# EAGLE design V1 (EAGLE 9.5.2)
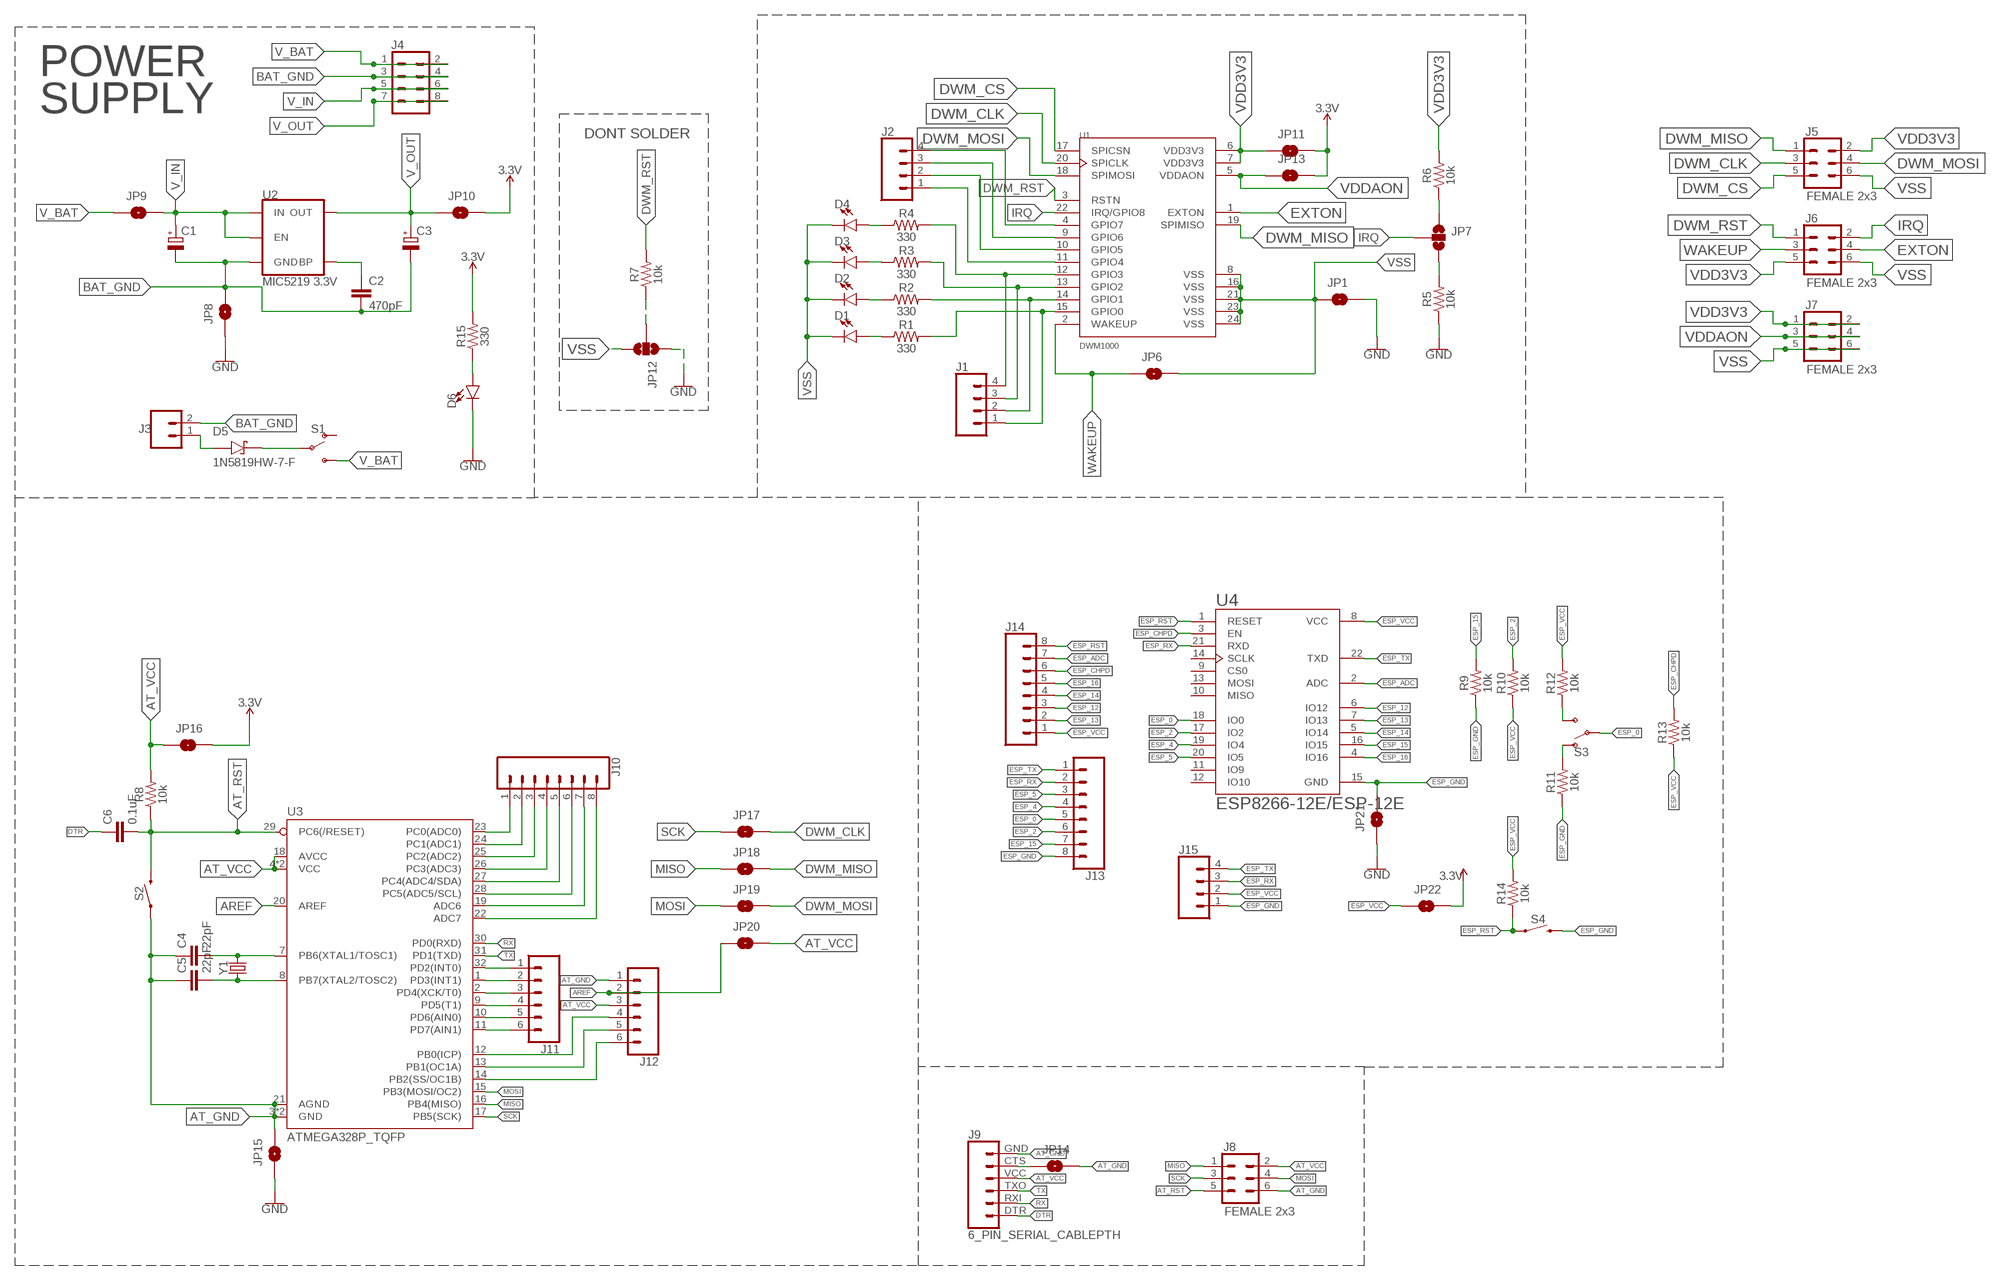
[diagram p0: schematic, sheet 1]

## Parts
C1  CPOL-EUSMCA  [SMC_A]
C2  470pF  470PF-0603-50V-5%  [0603]
C3  CPOL-EUSMCA  [SMC_A]
C4  22pF  22PF-0603-50V-5%  [0603]
C5  22pF  22PF-0603-50V-5%  [0603]
C6  0.1uF  0.1UF-0603-25V-(+80/-20%)  [0603]
D1  LED0603  [LED-0603]
D2  LED0603  [LED-0603]
D3  LED0603  [LED-0603]
D4  LED0603  [LED-0603]
D5  1N5819HW-7-F  [SOD3715X145N]
D6  LED0603  [LED-0603]
J1  CONN_04  [1X04]
J2  CONN_04  [1X04]
J3  CONN_02  [1X02]
J4  CONN_04X2  [2X4]
J5  FEMALE 2x3  CONN_03X2FEMALE  [2X3]
J6  FEMALE 2x3  CONN_03X2FEMALE  [2X3]
J7  FEMALE 2x3  CONN_03X2FEMALE  [2X3]
J8  FEMALE 2x3  CONN_03X2FEMALE  [2X3]
J9  6_PIN_SERIAL_CABLEPTH  [FTDI_BASIC]
J10  CONN_08"  [1X08]
J11  CONN_06SILK_FEMALE_PTH  [1X06]
J12  CONN_06SILK_FEMALE_PTH  [1X06]
J13  CONN_08"  [1X08]
J14  CONN_08"  [1X08]
J15  CONN_04  [1X04]
JP1  JUMPER-SMT_2_NO_NO-SILK  [SMT-JUMPER_2_NO_NO-SILK]
JP6  JUMPER-SMT_2_NO_NO-SILK  [SMT-JUMPER_2_NO_NO-SILK]
JP7  JUMPER-SMT_3_NO_NO_SILK  [SMT-JUMPER_3_0-NO_TRACE_NO-SILK]
JP8  JUMPER-SMT_2_NO_NO-SILK  [SMT-JUMPER_2_NO_NO-SILK]
JP9  JUMPER-SMT_2_NO_NO-SILK  [SMT-JUMPER_2_NO_NO-SILK]
JP10  JUMPER-SMT_2_NO_NO-SILK  [SMT-JUMPER_2_NO_NO-SILK]
JP11  JUMPER-SMT_2_NO_NO-SILK  [SMT-JUMPER_2_NO_NO-SILK]
JP12  JUMPER-SMT_3_NO_NO_SILK  [SMT-JUMPER_3_0-NO_TRACE_NO-SILK]
JP13  JUMPER-SMT_2_NO_NO-SILK  [SMT-JUMPER_2_NO_NO-SILK]
JP14  JUMPER-SMT_2_NO_NO-SILK  [SMT-JUMPER_2_NO_NO-SILK]
JP15  JUMPER-SMT_2_NO_NO-SILK  [SMT-JUMPER_2_NO_NO-SILK]
JP16  JUMPER-SMT_2_NO_NO-SILK  [SMT-JUMPER_2_NO_NO-SILK]
JP17  JUMPER-SMT_2_NO_NO-SILK  [SMT-JUMPER_2_NO_NO-SILK]
JP18  JUMPER-SMT_2_NO_NO-SILK  [SMT-JUMPER_2_NO_NO-SILK]
JP19  JUMPER-SMT_2_NO_NO-SILK  [SMT-JUMPER_2_NO_NO-SILK]
JP20  JUMPER-SMT_2_NO_NO-SILK  [SMT-JUMPER_2_NO_NO-SILK]
JP21  JUMPER-SMT_2_NO_NO-SILK  [SMT-JUMPER_2_NO_NO-SILK]
JP22  JUMPER-SMT_2_NO_NO-SILK  [SMT-JUMPER_2_NO_NO-SILK]
R1  330  330OHM-0603-1/10W-1%  [0603]
R2  330  330OHM-0603-1/10W-1%  [0603]
R3  330  330OHM-0603-1/10W-1%  [0603]
R4  330  330OHM-0603-1/10W-1%  [0603]
R5  10k  10KOHM-0603-1/10W-1%  [0603]
R6  10k  10KOHM-0603-1/10W-1%  [0603]
R7  10k  10KOHM-0603-1/10W-1%  [0603]
R8  10k  10KOHM-0603-1/10W-1%  [0603]
R9  10k  10KOHM-0603-1/10W-1%  [0603]
R10  10k  10KOHM-0603-1/10W-1%  [0603]
R11  10k  10KOHM-0603-1/10W-1%  [0603]
R12  10k  10KOHM-0603-1/10W-1%  [0603]
R13  10k  10KOHM-0603-1/10W-1%  [0603]
R14  10k  10KOHM-0603-1/10W-1%  [0603]
R15  330  330OHM-0603-1/10W-1%  [0603]
S1  SWITCH-SPDT-SMD-AYZ0202  [SWITCH_DPDT_SMD_AYZ0202]
S2  MOMENTARY-SWITCH-SPST-SMD-6.0X3.5MM  [TACTILE_SWITCH_SMD_6.0X3.5MM]
S3  SWITCH-SPDT-SMD-AYZ0202  [SWITCH_DPDT_SMD_AYZ0202]
S4  MOMENTARY-SWITCH-SPST-SMD-6.0X3.5MM  [TACTILE_SWITCH_SMD_6.0X3.5MM]
U1  DWM1000  [XCVR_DWM1000]
U2  MIC5219 3.3V  V_REG_MIC52193.3V  [SOT23-5]
U3  ATMEGA328P_TQFP  [TQFP32-08]
U4  ESP8266-12E/ESP-12E  [XCVR_ESP8266-12E/ESP-12E]
Y1  CRYSTALSMD-HC49UP  [HC49UP]

## Nets
3.3V: JP10.2 JP11.2 JP13.2 JP16.2 JP22.2 R15.2
AREF: J12.2 JP20.1 U3.20(AREF)
AT_GND: C4.1 C5.1 J8.6 J9.GND J12.1 JP14.2 JP15.2 S2.1 U3.3(GND) U3.5(GND) U3.21(AGND)
AT_RST: C6.2 J8.5 R8.1 S2.2 U3.29(PC6(/RESET))
AT_VCC: J8.2 J9.VCC J12.3 JP16.1 JP20.2 R8.2 U3.4(VCC) U3.6(VCC) U3.18(AVCC)
BAT_GND: C1.- C2.2 C3.- J3.2 J4.3 J4.4 JP8.2 U2.2(GND)
DTR: C6.1 J9.DTR
DWM_CLK: J5.3 JP17.2 U1.20(SPICLK)
DWM_CS: J5.5 U1.17(SPICSN)
DWM_MISO: J5.1 JP18.2 U1.19(SPIMISO)
DWM_MOSI: J5.4 JP19.2 U1.18(SPIMOSI)
DWM_RST: J6.1 R7.2 U1.3(RSTN)
ESP_0: J13.5 S3.2(P) U4.18(IO0)
ESP_2: J13.6 R10.2 U4.17(IO2)
ESP_4: J13.4 U4.19(IO4)
ESP_5: J13.3 U4.20(IO5)
ESP_12: J14.3 U4.6(IO12)
ESP_13: J14.2 U4.7(IO13)
ESP_14: J14.4 U4.5(IO14)
ESP_15: J13.7 R9.2 U4.16(IO15)
ESP_16: J14.5 U4.4(IO16)
ESP_ADC: J14.7 U4.2(ADC)
ESP_CHPD: J14.6 R13.2 U4.3(EN)
ESP_GND: J13.8 J15.1 JP21.2 R9.1 R11.1 S4.2 U4.15(GND)
ESP_RST: J14.8 R14.1 S4.1 U4.1(RESET)
ESP_RX: J13.2 J15.3 U4.21(RXD)
ESP_TX: J13.1 J15.4 U4.22(TXD)
ESP_VCC: J14.1 J15.2 JP22.1 R10.1 R12.2 R13.1 R14.2 U4.8(VCC)
EXTON: J6.4 U1.1(EXTON)
GND: D6.C JP1.2 JP8.1 JP12.1 JP15.1 JP21.1 R5.1
IN_BAT: D5.C(K) S1.2(P)
IRQ: J6.2 JP7.2 U1.22(IRQ/GPIO8)
MISO: J8.1 JP18.1 U3.16(PB4(MISO))
MOSI: J8.4 JP19.1 U3.15(PB3(MOSI/OC2))
N$1: J1.4 R4.2 U1.12(GPIO3)
N$2: C2.1 U2.4(BP)
N$3: J1.3 R3.2 U1.13(GPIO2)
N$4: J1.2 R2.2 U1.14(GPIO1)
N$5: J1.1 R1.2 U1.15(GPIO0)
N$6: D4.A R4.1
N$7: D3.A R3.1
N$8: D2.A R2.1
N$9: D1.A R1.1
N$14: J2.1 U1.11(GPIO4)
N$15: JP7.1 R6.1
N$16: J2.2 U1.10(GPIO5)
N$17: J2.3 U1.9(GPIO6)
N$18: J2.4 U1.4(GPIO7)
N$19: JP7.3 R5.2
N$20: D5.A J3.1
N$21: C4.2 U3.7(PB6(XTAL1/TOSC1)) Y1.2
N$22: JP12.2 R7.1
N$23: C5.2 U3.8(PB7(XTAL2/TOSC2)) Y1.1
N$24: J10.1 U3.23(PC0(ADC0))
N$25: J10.2 U3.24(PC1(ADC1))
N$26: J10.3 U3.25(PC2(ADC2))
N$27: J10.4 U3.26(PC3(ADC3))
N$28: J9.CTS JP14.1
N$29: J10.5 U3.27(PC4(ADC4/SDA))
N$30: J10.6 U3.28(PC5(ADC5/SCL))
N$31: J10.7 U3.19(ADC6)
N$32: J10.8 U3.22(ADC7)
N$33: J11.1 U3.32(PD2(INT0))
N$34: J11.2 U3.1(PD3(INT1))
N$35: J11.3 U3.2(PD4(XCK/T0))
N$36: J11.4 U3.9(PD5(T1))
N$37: J11.5 U3.10(PD6(AIN0))
N$38: J11.6 U3.11(PD7(AIN1))
N$39: J12.5 U3.13(PB1(OC1A))
N$40: J12.4 U3.12(PB0(ICP))
N$41: J12.6 U3.14(PB2(SS/OC1B))
N$42: R11.2 S3.1(O)
N$43: R12.1 S3.3(S)
N$44: D6.A R15.1
RX: J9.RXI U3.30(PD0(RXD))
SCK: J8.3 JP17.1 U3.17(PB5(SCK))
TX: J9.TXO U3.31(PD1(TXD))
V_BAT: J4.1 J4.2 JP9.1 S1.3(S)
V_IN: C1.+ J4.5 J4.6 JP9.2 U2.1(IN) U2.3(EN)
V_OUT: C3.+ J4.7 J4.8 JP10.1 U2.5(OUT)
VDD3V3: J5.2 J6.5 J7.1 J7.2 JP11.1 R6.2 U1.6(VDD3V3) U1.7(VDD3V3)
VDDAON: J7.3 J7.4 JP13.1 U1.5(VDDAON)
VSS: D1.C D2.C D3.C D4.C J5.6 J6.6 J7.5 J7.6 JP1.1 JP6.2 JP12.3 U1.8(VSS) U1.16(VSS) U1.21(VSS) U1.23(VSS) U1.24(VSS)
WAKEUP: J6.3 JP6.1 U1.2(WAKEUP)
Unconnected: S1.1(O) U4.9(CS0) U4.10(MISO) U4.11(IO9) U4.12(IO10) U4.13(MOSI) U4.14(SCLK)

## Notes on the sheet
- POWER
- SUPPLY
- DONT SOLDER

## Library data of the parts
C1 C3 = resistor:CPOL-EU: POLARIZED CAPACITOR, European symbol
C2 = SparkFun-Capacitors:470PF: 470pF ceramic capacitors A capacitor is a passive two-terminal electrical component used to store electrical energy temporarily in an electric field.; PROD_ID: CAP-07884
C4 C5 = SparkFun-Capacitors:22PF: 22pF ceramic capacitors A capacitor is a passive two-terminal electrical component used to store electrical energy temporarily in an electric field.; PROD_ID: CAP-07876
C6 = SparkFun-Capacitors:0.1UF: 0.1µF ceramic capacitors A capacitor is a passive two-terminal electrical component used to store electrical energy temporarily in an electric field.; PROD_ID: CAP-00810
D1-D4 D6 = SparkFun-LED:LED: LED (Generic) Standard schematic elements and footprints for 5mm, 3mm, 1206, and 0603 sized LEDs. Generic LEDs with no color specified.
D5 = 1N5819HW-7-F:1N5819HW-7-F: 1N5819HW Series 40 V 1 A Surface Mount Schottky Barrier Rectifier - SOD-123; AVAILABILITY: Unavailable; DESCRIPTION: 1N5819HW Series 40 V 1 A Surface Mount Schottky Barrier Rectifier - SOD-123; MF: Diodes Inc.; MP: 1N5819HW-7-F; PACKAGE: SOD-123 Diodes Inc.; PRICE: None
J1 J2 J15 = SparkFun-Connectors:CONN_04: Multi connection point. Often used as Generic Header-pin footprint for 0.1 inch spaced/style header connections On any of the 0.1 inch spaced packages, you can populate with these: Break Away Headers - Straight (PRT-00116) Break Away Male Headers - Right Angle (PRT-00553) Female Headers (PRT-00115) Break Away Headers - Machine Pin (PRT-00117) Break Away Female Headers - Swiss Machine Pin (PRT-00743) For SCREWTERMINALS and SPRING TERMINALS visit here: Screw Terimnals on SparkFun.com (5mm/3.5mm/2.54mm spacing) This device is also useful as a general connection point to wire up your design to another part of your project. Our various solder wires solder well into these plated through hole pads. Hook-Up Wire - Assortment (Stranded, 22 AWG) (PRT-11375) Hook-Up Wire - Assortment (Solid Core, 22 AWG) (PRT-11367) View the entire wire category on our website here Special notes: Molex polarized connector foot print use with SKU : PRT-08231 with associated crimp pins and housings. 1MM SMD Version SKU: PRT-10208; PROD_ID: CONN-09696
J3 = SparkFun-Connectors:CONN_02: Multi connection point. Often used as Generic Header-pin footprint for 0.1 inch spaced/style header connections On any of the 0.1 inch spaced packages, you can populate with these: Break Away Headers - Straight (PRT-00116) Break Away Male Headers - Right Angle (PRT-00553) Female Headers (PRT-00115) Break Away Headers - Machine Pin (PRT-00117) Break Away Female Headers - Swiss Machine Pin (PRT-00743) For SCREWTERMINALS and SPRING TERMINALS visit here: Screw Terimnals on SparkFun.com (5mm/3.5mm/2.54mm spacing) This device is also useful as a general connection point to wire up your design to another part of your project. Our various solder wires solder well into these plated through hole pads. Hook-Up Wire - Assortment (Stranded, 22 AWG) (PRT-11375) Hook-Up Wire - Assortment (Solid Core, 22 AWG) (PRT-11367) View the entire wire category on our website here Special notes: Molex polarized connector foot print use with: PRT-08233 with associated crimp pins and housings. 2.54_SCREWTERM for use with PRT-10571. 3.5mm Screw Terminal footprints for PRT-08084 5mm Screw Terminal footprints for use with PRT-08432
J4 = SparkFun-Connectors:CONN_04X2: Multi connection point. Often used as Generic Header-pin footprint for 0.1 inch spaced/style header connections On any of the 0.1 inch spaced packages, you can populate with these: Break Away Headers - Straight (PRT-00116) Break Away Male Headers - Right Angle (PRT-00553) Female Headers (PRT-00115) Break Away Headers - Machine Pin (PRT-00117) Break Away Female Headers - Swiss Machine Pin (PRT-00743)
J5-J8 = SparkFun-Connectors:CONN_03X2: Multi connection point. Often used as Generic Header-pin footprint for 0.1 inch spaced/style header connections You can populate with any combo of single row headers, but if you'd like an exact match, check these: Header - 2x3 (Male, 0.1") (PRT-12807) Header - 2x3 (Female, 0.1") (PRT-13010) 2x3 Pin Shrouded Header (PRT-10877) On any of the 0.1 inch spaced packages, you can populate with these: Break Away Headers - Straight (PRT-00116) Break Away Male Headers - Right Angle (PRT-00553) Female Headers (PRT-00115) Break Away Headers - Machine Pin (PRT-00117) Break Away Female Headers - Swiss Machine Pin (PRT-00743) Special note: the shrouded connector mates well with our 3x2 ribbon cables: Ribbon Crimp Connector - 6-pin (2x3, Female) (PRT-10651) Ribbon Cable - 6 wire (15ft) (PRT-10646); PROD_ID: CONN-11566
J9 = SparkFun-Connectors:6_PIN_SERIAL_CABLE: 6-pin header connection for use with the "FTDI BASIC" pinout - CABLE SIDE. Also known as "Arduino Serial Program Header". This is used on a design to provide a 6-pin connection point for serial communication usually from a USB cable (D+/D-) to these headers (RX/TX). It also has the remaining pins necessary for programming in the Arduino evironment (DTR, GND, and sometimes VCC). Note, this device has "CABLE" in the name. It is intended to be used on a design that usually lives on the end of your USB cable and prvides the converter chip (FTDI232 or FTDI231x) to commnicate serial RX/TX. The "sister" device, named "TARGET" is inteneded to be used on a design that contains a target micro-controller that you wish to program. You can populate with some of these: Female Headers (PRT-00115) For reference (or to suit your programming needs) check out these designs: SparkFun FTDI Basic Breakout - 5V (DEV-09716) SparkFun FTDI Basic Breakout - 3.3V (DEV-09873) SparkFun FTDI SmartBasic (DEV-12935) SparkFun Beefy 3 - FTDI Basic Breakout (DEV-13746)
J10 J13 J14 = SparkFun-Connectors:CONN_08: Multi connection point. Often used as Generic Header-pin footprint for 0.1 inch spaced/style header connections On any of the 0.1 inch spaced packages, you can populate with these: Break Away Headers - Straight (PRT-00116) Break Away Male Headers - Right Angle (PRT-00553) Female Headers (PRT-00115) Break Away Headers - Machine Pin (PRT-00117) Break Away Female Headers - Swiss Machine Pin (PRT-00743) Arduino Stackable Header - 8 Pin (PRT-09279) For SCREWTERMINALS and SPRING TERMINALS visit here: Screw Terimnals on SparkFun.com (5mm/3.5mm/2.54mm spacing) This device is also useful as a general connection point to wire up your design to another part of your project. Our various solder wires solder well into these plated through hole pads. Hook-Up Wire - Assortment (Stranded, 22 AWG) (PRT-11375) Hook-Up Wire - Assortment (Solid Core, 22 AWG) (PRT-11367) View the entire wire category on our website here Special notes: Molex polarized connector foot print use with SKU : PRT-08231 with associated crimp pins and housings. 1MM SMD Version SKU: PRT-10208 NOTES ON THE VARIANTS LOCK and LOCK_LONGPADS... This footprint was designed to help hold the alignment of a through-hole component (i.e. 6-pin header) while soldering it into place. You may notice that each hole has been shifted either up or down by 0.005 of an inch from it's more standard position (which is a perfectly straight line). This slight alteration caused the pins (the squares in the middle) to touch the edges of the holes. Because they are alternating, it causes a "brace" to hold the component in place. 0.005 has proven to be the perfect amount of "off-center" position when using our standard breakaway headers. Although looks a little odd when you look at the bare footprint, once you have a header in there, the alteration is very hard to notice. Also,if you push a header all the way into place, it is covered up entirely on the bottom side.; PROD_ID: CONN-08438
J11 J12 = SparkFun-Connectors:CONN_06: Multi connection point. Often used as Generic Header-pin footprint for 0.1 inch spaced/style header connections On any of the 0.1 inch spaced packages, you can populate with these: Break Away Headers - Straight (PRT-00116) Break Away Male Headers - Right Angle (PRT-00553) Female Headers (PRT-00115) Break Away Headers - Machine Pin (PRT-00117) Break Away Female Headers - Swiss Machine Pin (PRT-00743) Arduino Stackable Header - 6 Pin (PRT-09280) For SCREWTERMINALS and SPRING TERMINALS visit here: Screw Terimnals on SparkFun.com (5mm/3.5mm/2.54mm spacing) This device is also useful as a general connection point to wire up your design to another part of your project. Our various solder wires solder well into these plated through hole pads. Hook-Up Wire - Assortment (Stranded, 22 AWG) (PRT-11375) Hook-Up Wire - Assortment (Solid Core, 22 AWG) (PRT-11367) View the entire wire category on our website here; PROD_ID: CONN-08437
JP1 JP6 JP8-JP11 JP13-JP22 = SparkFun-Jumpers:JUMPER-SMT_2_NO: Normally open jumper This jumper has two pads in close proximity to each other. Apply solder to close the connection. Round pads are easier to solder for beginners, but are a lot larger. SparkFun Product that uses the round pads: SparkFun EL Sequencer
JP7 JP12 = SparkFun-Jumpers:JUMPER-SMT_3_NO: Normally open jumper This jumper has three pads in close proximity to each other. Apply solder to close the connection(s).
R1-R4 R15 = SparkFun-Resistors:330OHM: 330Ω resistor A resistor is a passive two-terminal electrical component that implements electrical resistance as a circuit element. Resistors act to reduce current flow, and, at the same time, act to lower voltage levels within circuits. - Wikipedia; PROD_ID: RES-00818
R5-R14 = SparkFun-Resistors:10KOHM: 10kΩ resistor A resistor is a passive two-terminal electrical component that implements electrical resistance as a circuit element. Resistors act to reduce current flow, and, at the same time, act to lower voltage levels within circuits. - Wikipedia; PROD_ID: RES-00824
S1 S3 = SparkFun-Switches:SWITCH-SPDT: Single Pole, Double Throw (SPDT) Switch Single-pole, double-throw (SPDT) switch. Variant Overview SMD-AYZ0202 Surface Mount DPDT Switch (COM-00597) Used on e.g. LilyPad Arduino USB - ATmega32U4 Board PTH-11.6X4.0MM SPDT Mini Power Switch (COM-00102) Used on e.g. SparkFun Simon Says - Through-Hole Soldering Kit (KIT-10547) PTH-11.6X4.0MM-KIT KIT version of SPDT Mini Power Switch - Simplifies soldering by removing tStop of switch pins - only one side can be soldered. PTH-11.6X4.0MM-LOCK LOCK version of SPDT Mini Power Switch - Offset pins hold switch in place for easier soldering. SMD-RIGHT-ANGLE Surface Mount Right Angle Switch (COM-10860) Used on e.g. SparkFun ESP8266 Thing; PROD_ID: SWCH-08179; SF_ID: COM-00597
S2 S4 = SparkFun-Switches:MOMENTARY-SWITCH-SPST: Momentary Switch (Pushbutton) - SPST Normally-open (NO) SPST momentary switches (buttons, pushbuttons). Variants PTH-12MM - 12mm square, through-hole Momentary Pushbutton Switch - 12mm Square (COM-09190) PTH-6.0MM, PTH-6.0MM-KIT - 6.0mm square, through-hole Mini Pushbutton Switch (COM-00097) KIT package intended for soldering kit's - only one side of pads' copper is exposed. PTH-RIGHT-ANGLE-KIT - Right-angle, through-hole Right Angle Tactile Button - Used on SparkFun BigTime Watch Kit SMD-12MM - 12mm square, surface-mount Tactile Button - SMD (12mm) (COM-12993) Used on SparkFun PicoBoard SMD-4.5MM - 4.5mm Square Trackball Switch Used on SparkFun Blackberry Trackballer Breakout SMD-4.6MMX2.8MM - 4.60mm x 2.80mm, surface mount Used on SparkFun SAMD21 Mini Breakout SMD-5.2MM, SMD-5.2-REDUNDANT - 5.2mm square, surface-mount Mini Pushbutton Switch - SMD (COM-08720) Used on Arduino Pro Mini REDUNDANT package connects both switch circuits together SMD-6.0X3.5MM - 6.0 x 3.5mm, surface mount Momentary Reset Switch SMD (COM-08229) SMD-6.2MM-TALL - 6.2mm square, surface mount Tactile Button - SMD (6mm) Used on SparkFun Digital Sandbox SMD-RIGHT-ANGLE - Right-angle, surface mount Used on SparkFun Block for Intel® Edison - Arduino; PROD_ID: SWCH-00815; SF_SKU: COM-08229
U1 = DWM1000:DWM1000: Mod Ieee802.15.4-2011 Uwb Txrx; AVAILABILITY: Unavailable; DESCRIPTION: Mod Ieee802.15.4-2011 Uwb Txrx; MF: Decawave Limited; MP: DWM1000; PACKAGE: Module Decawave; PRICE: None
U2 = SparkFun-IC-Power:V_REG_MIC5219: V_REG MIC5219 Standard 3.3V and 5V 500mA LDO voltage regulator in SOT-23 layout. Micrel part MIC5219. BP (by-pass) pin is used to lower output noise with 470pF cap, may be left open.; PROD_ID: VREG-09872
U3 = SparkFun-IC-Microcontroller:ATMEGA328P_TQFP: Popular 328P in QFP Storefront component: ATmega328 - TQFP (COM-13448) Datasheet SparkFun Products SparkFun RedBoard - Programmed with Arduino (DEV-12757) Arduino Pro Mini 328 - 5V/16MHz (DEV-11113) Arduino Pro Mini 328 - 3.3V/8MHz (DEV-11114) SparkFun OpenLog (DEV-13712) SparkFun MicroView - OLED Arduino Module (DEV-12923) SparkFun Digital Sandbox (DEV-12651) SparkFun PicoBoard (WIG-11888) Arduino Fio (DEV-10116) LilyPad Arduino 328 Main Board (DEV-13342) SparkFun RedStick (DEV-13741) LilyPad MP3 (DEV-11013) LilyPad Arduino SimpleSnap (DEV-10941) SparkFun Stepoko (ROB-13899) SparkFun Geiger Counter (SEN-11345) SparkFun EL Sequencer (COM-12781) Arduino Pro 328 - 5V/16MHz (DEV-10915) CryptoCape (DEV-12773) SparkFun IR Thermometer Evaluation Board - MLX90614 (SEN-10740) SparkFun RedBot Mainboard (ROB-12097) Arduino Pro 328 - 3.3V/8MHz (DEV-10914) SparkFun Block for Intel® Edison - Arduino (DEV-13036) SparkFun Simon Says - Surface Mount Soldering Kit (KIT-10935) SparkFun 7-Segment Serial Display - Red (COM-11441) SparkFun 7-Segment Serial Display - White (COM-11629) SparkFun 7-Segment Serial Display - Yellow (COM-11443) SparkFun 7-Segment Serial Display - Kelly Green (COM-11440) SparkFun 7-Segment Serial Display - Blue (COM-11442) SparkFun OpenSegment Serial Display - 20mm (Blue) (COM-11647) SparkFun OpenSegment Serial Display - 20mm (Green) (COM-11646) SparkFun OpenSegment Serial Display - 20mm (White) (COM-11648) SparkFun OpenSegment Serial Display - 20mm (Red) (COM-11644) SparkFun OpenSegment Serial Display - 20mm (Yellow) (COM-11645) SparkFun OpenSegment Shield (DEV-13190); PROD_ID: IC-09069
U4 = ESP8266-12E_ESP-12E:ESP8266-12E/ESP-12E: ESP-12E WiFi Module; AVAILABILITY: Unavailable; DESCRIPTION: This WiFi module has a 32-bit MCU micro and clock speeds supporting 80 MHz or 160 MHz. Supports the RTOS and integrated Wi-Fi MAC/BB/RF/PA/LNA, and has an on-board antenna.; MF: AI-Thinker; MP: ESP8266-12E/ESP-12E; PACKAGE: None; PRICE: None
Y1 = SparkFun-Clocks:CRYSTAL: Crystals (Generic) These are passive quartz crystals, which can be used as a clock source for a microcontroller. Crystal's are two-terminal devices. They require external "load" capacitors to generate an oscillating signal.

## Board
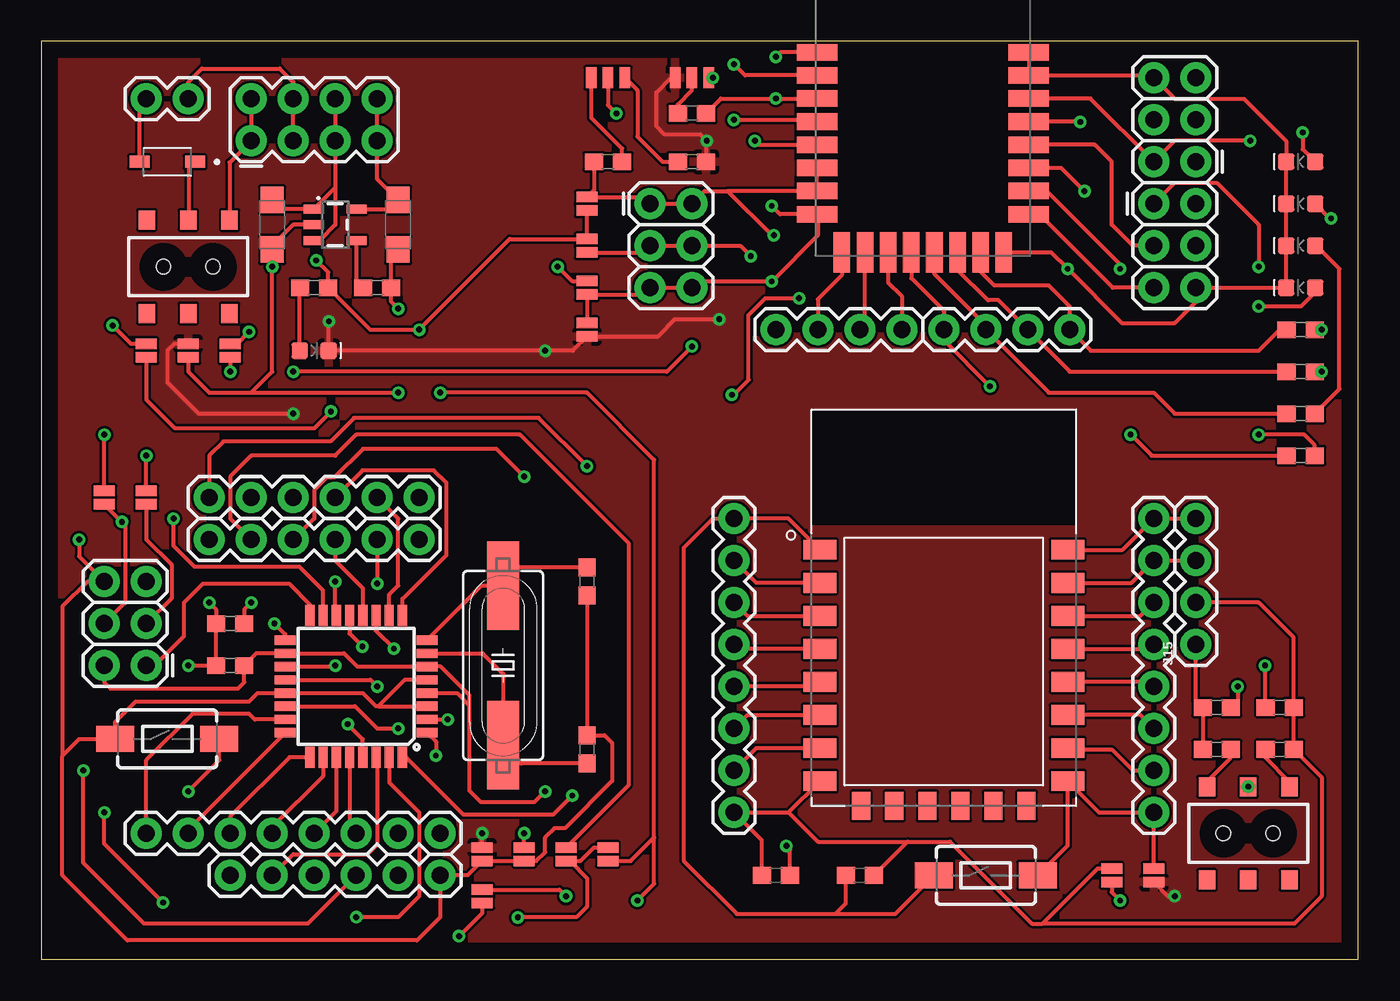
[diagram p1: board, top side]
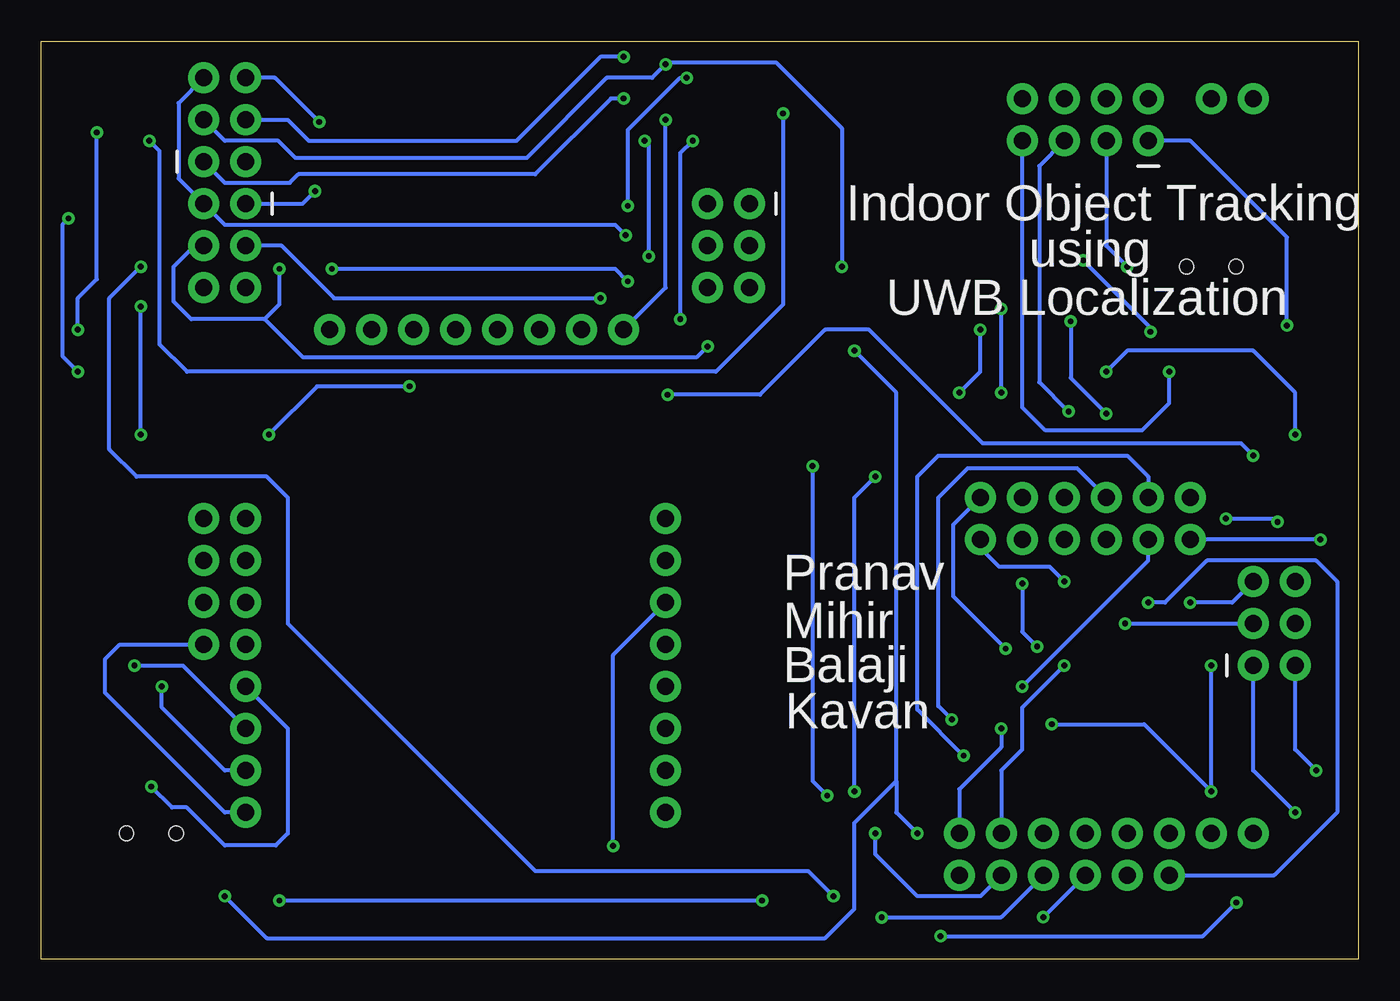
[diagram p2: board, bottom side, seen from below]

Size 79.68 x 55.55 mm. Coordinates in mm from the lower left corner, seen from the top.
Outline: 0,0 79.68,0 79.68,55.55 0,55.55 0,0
Copper layers (1*16): Top 0.035mm / dielectric 1.5mm / Bottom 0.035mm
Design rules "default": minimum track width 6mil, minimum drill 0.35mm, track to track 6mil, track to pad 6mil, pad to pad 6mil, via to via 6mil, smd to smd 6mil, copper to edge 40mil, drill to drill 6mil, minimum pad ring 10mil, minimum via ring 8mil, stop-mask expansion 4mil, vias tented up to drill 0mil, thermal gap 10mil

### Footprints (pad centres in the part's own frame; a part is rotated, then mirrored left to right if it is on the bottom)
SMC_A = smd 1.6 x 1.4: + -1.5,0; - 1.5,0
0603 = smd 1.1 x 1: 1 -0.85,0; 2 0.85,0
LED-0603 = smd 1 x 1: A -0.877,0; C 0.877,0
SOD3715X145N = smd 1.21 x 0.73: A 1.68,0; C -1.68,0
1X04 = drill 1.016 pad 1.88: 1 0,0; 2 2.54,0; 3 5.08,0; 4 7.62,0
1X02 = drill 1.016 pad 1.88: 1 0,0; 2 2.54,0
2X4 = drill 1.016 pad 1.88: 1 -3.81,-1.27; 2 -3.81,1.27; 3 -1.27,-1.27; 4 -1.27,1.27; 5 1.27,-1.27; 6 1.27,1.27; 7 3.81,-1.27; 8 3.81,1.27
2X3 = drill 1.016 pad 1.88: 1 0,0; 2 0,2.54; 3 2.54,0; 4 2.54,2.54; 5 5.08,0; 6 5.08,2.54
FTDI_BASIC = drill 1.016 pad 1.88: CTS 10.16,0; DTR 0,0; GND 12.7,0; RXI 2.54,0; TXO 5.08,0; VCC 7.62,0
1X08 = drill 1.016 pad 1.88: 1 0,0; 2 2.54,0; 3 5.08,0; 4 7.62,0; 5 10.16,0; 6 12.7,0; 7 15.24,0; 8 17.78,0
1X06 = drill 1.016 pad 1.88: 1 0,0; 2 2.54,0; 3 5.08,0; 4 7.62,0; 5 10.16,0; 6 12.7,0
SMT-JUMPER_2_NO_NO-SILK = smd 0.635 x 1.27: 1 -0.406,0; 2 0.406,0
SMT-JUMPER_3_0-NO_TRACE_NO-SILK = smd 0.635 x 1.27: 1 -1.016,0; 2 0,0; 3 1.016,0
SWITCH_DPDT_SMD_AYZ0202 = smd 1 x 1.15: 1 -2.5,2.825; 2 0,2.825; 3 2.5,2.825; 4 -2.5,-2.825; 5 0,-2.825; 6 2.5,-2.825 | hole 0.85: 1.5,0; -1.5,0
TACTILE_SWITCH_SMD_6.0X3.5MM = smd 2.3 x 1.6: 1 -3.15,0; 2 3.15,0
XCVR_DWM1000 = smd 2.45 x 1: 1 -6.4,1.8; 2 -6.4,0.4; 3 -6.4,-1; 4 -6.4,-2.4; 5 -6.4,-3.8; 6 -6.4,-5.2; 7 -6.4,-6.6; 8 -6.4,-8; 17 6.4,-8; 18 6.4,-6.6; 19 6.4,-5.2; 20 6.4,-3.8; 21 6.4,-2.4; 22 6.4,-1; 23 6.4,0.4; 24 6.4,1.8 | smd 1 x 2.45: 9 -4.9,-10.295; 10 -3.5,-10.295; 11 -2.1,-10.295; 12 -0.7,-10.295; 13 0.7,-10.295; 14 2.1,-10.295; 15 3.5,-10.295; 16 4.9,-10.295
SOT23-5 = smd 0.55 x 1.2: 1 -0.95,-1.3; 2 0,-1.3; 3 0.95,-1.3; 4 0.95,1.3; 5 -0.95,1.3
TQFP32-08 = smd 1.27 x 0.559: 1 -4.293,2.8; 2 -4.293,2; 3 -4.293,1.2; 4 -4.293,0.4; 5 -4.293,-0.4; 6 -4.293,-1.2; 7 -4.293,-2; 8 -4.293,-2.8; 17 4.293,-2.8; 18 4.293,-2; 19 4.293,-1.2; 20 4.293,-0.4; 21 4.293,0.4; 22 4.293,1.2; 23 4.293,2; 24 4.293,2.8 | smd 0.559 x 1.27: 9 -2.8,-4.293; 10 -2,-4.293; 11 -1.2,-4.293; 12 -0.4,-4.293; 13 0.4,-4.293; 14 1.2,-4.293; 15 2,-4.293; 16 2.8,-4.293; 25 2.8,4.293; 26 2,4.293; 27 1.2,4.293; 28 0.4,4.293; 29 -0.4,4.293; 30 -1.2,4.293; 31 -2,4.293; 32 -2.8,4.293
XCVR_ESP8266-12E/ESP-12E = smd 2 x 1.2: 1 -7.5,7; 2 -7.5,5; 3 -7.5,3; 4 -7.5,1; 5 -7.5,-1; 6 -7.5,-3; 7 -7.5,-5; 8 -7.5,-7; 15 7.5,-7; 16 7.5,-5; 17 7.5,-3; 18 7.5,-1; 19 7.5,1; 20 7.5,3; 21 7.5,5; 22 7.5,7 | smd 1.1 x 1.7: 9 -5,-8.5; 10 -3,-8.5; 11 -1,-8.5; 12 1,-8.5; 13 3,-8.5; 14 5,-8.5
HC49UP = smd 5.334 x 1.93: 1 -4.826,0; 2 4.826,0

### Placement (x,y rotation side)
C1  13.97,44.45 270 top
C2  20.32,40.64 0 top
C3  21.59,44.45 270 top
C4  33.02,12.7 270 top
C5  33.02,22.86 90 top
C6  11.43,20.32 180 top
D1  76.2,48.26 180 top
D2  76.2,45.72 180 top
D3  76.2,43.18 180 top
D4  76.2,40.64 180 top
D5  7.62,48.26 180 top
D6  16.51,36.83 0 top
J1  62.23,38.1 180 top
J2  52.07,38.1 180 top
J3  6.35,52.07 0 top
J4  16.51,50.8 0 top
J5  67.31,45.72 270 top
J6  69.85,48.26 90 top
J7  36.83,45.72 270 top
J8  6.35,17.78 90 top
J9  11.43,5.08 0 top
J10  6.35,7.62 0 top
J11  10.16,27.94 0 top
J12  10.16,25.4 0 top
J13  67.31,26.67 270 top
J14  41.91,8.89 90 top
J15  69.85,19.05 90 top
JP1  33.02,38.1 270 top
JP6  33.02,40.64 270 top
JP7  34.29,53.34 0 top
JP8  8.89,36.83 270 top
JP9  6.35,36.83 270 top
JP10  11.43,36.83 90 top
JP11  33.02,45.72 270 top
JP12  39.37,53.34 0 top
JP13  33.02,43.18 90 top
JP14  29.21,6.35 270 top
JP15  26.67,6.35 270 top
JP16  34.29,6.35 270 top
JP17  6.35,27.94 90 top
JP18  26.67,3.81 90 top
JP19  3.81,27.94 90 top
JP20  31.75,6.35 270 top
JP21  67.31,5.08 90 top
JP22  64.77,5.08 270 top
R1  76.2,38.1 180 top
R2  76.2,35.56 180 top
R3  76.2,33.02 180 top
R4  76.2,30.48 180 top
R5  39.37,48.26 180 top
R6  34.29,48.26 180 top
R7  39.37,51.18 0 top
R8  11.43,17.78 0 top
R9  71.12,15.24 0 top
R10  74.93,15.24 180 top
R11  71.12,12.7 0 top
R12  74.93,12.7 0 top
R13  44.45,5.08 0 top
R14  49.53,5.08 0 top
R15  16.51,40.64 0 top
S1  8.89,41.91 0 top
S2  7.62,13.34 0 top
S3  73.03,7.62 0 top
S4  57.15,5.08 0 top
U1  53.34,53.09 0 top
U2  17.78,44.45 270 top
U3  19.05,16.51 180 top
U4  54.61,17.78 0 top
Y1  27.94,17.78 270 top

### Tracks (layer width: path | path; a pad name or v marks a point on that pad's centre or on a via)
3.3V  (via drill 0.35)
  Top 0.254: JP10.2 11.84,37.24 v12.57,37.97 | v16.64,42.29 17.36,41.57 R15.2 19.9,38.1 v22.86,38.1 28.35,43.59 JP13.2 JP11.2 | v65.28,3.56 64.77,4.06 JP22.2 | v24.13,34.29 33.02,34.29 37.08,30.23 37.08,7.37 | JP16.2 35.66,5.94 37.08,7.37 | v36.07,3.56 37.08,4.57 37.08,7.37
  Bottom 0.254: v16.64,42.29 12.57,38.23 v12.57,37.97 | v65.28,3.56 v36.07,3.56 | v24.13,34.29 22.86,35.56 v22.86,38.1
AREF  (via drill 0.35)
  Top 0.254: U3.20 19.92,16.91 v20.32,16.51 | J12.2 11.43,26.67 11.43,29.21 12.7,30.48 17.78,30.48 19.05,31.75 28.96,31.75 35.56,25.15 35.56,10.57 JP20.1
  Bottom 0.254: J12.2 12.7,24.13 v20.32,16.51
AT_GND  (via drill 0.35)
  Top 0.254: U3.5 21.99,16.91 20.39,15.31 | 1.27,12.32 1.27,5.08 5.21,1.14 22.73,1.14 24.13,2.54 J9.GND 25.81,5.08 JP15.2 JP14.2 29.95,5.94 30.48,6.48 30.48,7.37 31.05,7.94 31.69,7.94 34.54,10.79 34.54,13.08 34.08,13.55 C4.1 C5.1 | v2.29,25.4 2.29,24.38 J8.6 2.79,22.86 1.27,21.34 1.27,12.32 | 20.39,15.31 U3.3 | 20.39,15.31 20.25,15.31 19.45,16.11 U3.21 13.09,16.11 12.57,15.6 5.71,15.6 4.47,14.35 S2.1 2.29,13.34 1.27,12.32
  Bottom 0.254: v2.29,25.4 J12.1
AT_RST  (via drill 0.35)
  Top 0.254: U3.29 19.45,13.32 v18.54,14.22 | v8.89,17.78 R8.1 C6.2 10.58,21.17 v10.16,21.59 | v8.89,10.16 10.77,12.04 S2.2
  Bottom 0.254: v18.54,14.22 12.95,14.22 v8.89,10.16 v8.89,17.78 | J8.5 7.62,21.59 v10.16,21.59
AT_VCC  (via drill 0.35)
  Top 0.254: J9.VCC 16.13,2.16 6.22,2.16 2.54,5.84 v2.54,11.43 | J8.2 3.81,16.76 4.19,16.38 11.9,16.38 12.28,16.76 R8.2 13.01,18.51 U3.18 18.32,18.51 19.12,17.71 U3.6 24.16,17.71 25.89,15.98 25.89,15.37 | v28.83,2.54 32.38,2.54 33.02,3.17 33.02,4.9 31.98,5.94 | JP16.1 33.43,6.76 32.61,5.94 31.98,5.94 | 25.89,15.37 25.89,10.22 26.61,9.5 29.82,9.5 v30.48,10.16 | v29.21,29.21 27.53,30.89 19.46,30.89 17.73,29.16 17.27,29.16 16.51,28.39 16.51,26.67 J12.3 | U3.4 25.15,16.11 25.89,15.37 | JP20.2 31.98,5.94
  Bottom 0.254: v2.54,11.43 3.81,12.7 J8.2 | J9.VCC 21.59,2.54 v28.83,2.54 | v30.48,10.16 30.48,27.94 v29.21,29.21
BAT_GND  (via drill 0.35)
  Top 0.254: JP8.2 8.89,35.56 10.16,34.29 12.7,34.29 | 12.7,34.29 13.97,35.56 v13.97,41.91 C1.- 13.97,43.18 15.24,44.45 U2.2 | C3.- 21.17,42.53 C2.2 21.17,39.79 v21.59,39.37 | 12.7,34.29 v21.59,34.29 | J3.2 8.89,53.09 9.7,53.9 14.43,53.9 15.24,53.09 J4.4 J4.3
  Bottom 0.254: J4.3 15.24,43.18 v13.97,41.91 | v21.59,34.29 v21.59,39.37
DTR  (via drill 0.35)
  Top 0.254: v12.7,21.59 12.28,21.17 C6.1
  Bottom 0.254: v12.7,21.59 11.68,21.59 9.14,24.13 2.54,24.13 1.27,22.86 1.27,8.89 5.08,5.08 J9.DTR
DWM_CLK  (via drill 0.35)
  Top 0.254: J5.3 66.04,43.18 64.77,44.45 64.77,48.26 63.74,49.29 U1.20 | JP17.2 v6.35,30.48 | v41.78,34.16 41.91,34.16 42.8,35.05 42.8,38.99 43.81,40.01 v45.85,40.01
  Bottom 0.254: v6.35,30.48 7.09,31.22 22.72,31.22 29.6,38.1 32.26,38.1 36.2,34.16 v41.78,34.16 | v45.85,40.01 61.98,40.01 65.15,43.18 J5.3
DWM_CS
  Top 0.254: U1.17 60.38,45.09 64.82,40.64 J5.5
DWM_MISO  (via drill 0.35)
  Top 0.254: J5.1 68.58,46.99 71.12,46.99 73.66,44.45 v73.66,41.91 | v63.12,46.48 61.72,47.89 U1.19 | JP18.2 31.34,4.22 v31.75,3.81
  Bottom 0.254: J5.1 63.88,45.72 v63.12,46.48 | v31.75,3.81 33.27,5.33 49.78,5.33 64.77,20.32 64.77,27.94 66.04,29.21 73.91,29.21 75.56,30.86 75.56,40.01 v73.66,41.91
DWM_MOSI  (via drill 0.35)
  Top 0.254: U1.18 60.83,46.49 65.28,42.04 v65.28,41.78 | v39.37,37.08 37.85,35.56 v15.24,35.56 | JP19.2 v3.81,31.75
  Bottom 0.254: v65.28,41.78 65.28,39.62 66.17,38.73 | J5.4 70.41,43.18 71.68,41.91 71.68,39.8 70.61,38.73 66.17,38.73 | 66.17,38.73 63.88,36.45 40.01,36.45 v39.37,37.08 | v3.81,31.75 3.81,34.29 6.35,36.83 13.97,36.83 v15.24,35.56
DWM_RST  (via drill 0.35)
  Top 0.254: R7.2 41.12,52.09 v44.45,52.09 U1.3
  Bottom 0.254: J6.1 68.58,46.99 64.64,46.99 64.14,47.5 49.8,47.5 45.21,52.09 v44.45,52.09
ESP_0  (via drill 0.35)
  Top 0.254: J13.5 67.04,16.78 U4.18
  Bottom 0.254: J13.5 64.77,13.97 64.77,7.62 65.5,6.89 68.58,6.89 70.88,9.19 71.77,9.19 S3.2
  other vias: 73.03,10.45
ESP_2  (via drill 0.35)
  Top 0.254: J13.6 66.5,14.78 U4.17 | R10.2 74.04,15.28 v74.04,17.78
  Bottom 0.254: v74.04,17.78 71.12,17.78 J13.6
ESP_4
  Top 0.254: U4.19 67.04,18.78 J13.4
ESP_5
  Top 0.254: U4.20 66.5,20.78 J13.3
ESP_12
  Top 0.254: J14.3 42.72,14.78 U4.6
ESP_13
  Top 0.254: J14.2 43.26,12.78 U4.7
ESP_14
  Top 0.254: U4.5 46.84,16.51 J14.4
ESP_15  (via drill 0.35)
  Top 0.254: U4.16 62.19,12.7 64.77,12.7 66.04,11.43 J13.7 | v72.39,16.51 72.39,15.66 R9.2
  Bottom 0.254: J13.7 68.58,11.43 72.39,15.24 v72.39,16.51
ESP_16
  Top 0.254: U4.4 42.18,18.78 J14.5
ESP_ADC
  Top 0.254: U4.2 43.26,22.78 J14.7
ESP_CHPD  (via drill 0.35)
  Top 0.254: J14.6 42.72,20.78 U4.3 | R13.2 45.3,6.64 v45.09,6.86
  Bottom 0.254: v45.09,6.86 45.09,18.41 J14.6
ESP_GND
  Top 0.254: S4.2 62.11,6.89 U4.15 64,8.89 J13.8 JP21.2 | J15.1 69.85,15.66 R9.1 R11.1
  Bottom 0.254: J13.8 68.58,8.89 75.82,16.13 75.82,18.16 74.93,19.05 J15.1
ESP_RST
  Top 0.254: U4.1 45.22,26.67 J14.8 40.64,26.67 38.86,24.89 38.86,5.97 42.08,2.75 48.05,2.75 | 48.05,2.75 48.68,3.38 R14.1 | 48.05,2.75 51.67,2.75 S4.1
ESP_RX
  Top 0.254: U4.21 65.96,22.78 J13.2 J15.3
ESP_TX
  Top 0.254: U4.22 65.42,24.78 J13.1 J15.4
ESP_VCC
  Top 0.254: 45.22,8.89 J14.1 43.6,7.2 R13.1 | 45.22,8.89 U4.8 | R14.2 52.41,7.11 | 52.41,7.11 54.99,7.11 59.94,2.16 60.58,2.16 | 45.22,8.89 47,7.11 52.41,7.11 | J15.2 73.66,21.59 75.78,19.47 R10.1 R12.2 77.47,11.01 77.47,3.81 75.82,2.16 60.58,2.16 | JP22.1 63.91,5.49 62.74,4.32 60.58,2.16
EXTON  (via drill 0.35)
  Top 0.254: U1.1 44.73,54.89 v44.45,54.61
  Bottom 0.254: J6.4 64.77,50.8 63.5,49.53 50.93,49.53 45.85,54.61 v44.45,54.61
GND  (via drill 0.35)
  Top 0.254: JP8.1 8.03,37.24 7.62,36.83 7.62,34.92 9.53,33.02 v15.24,33.02 | v17.4,38.61 17.39,38.6 D6.C v30.48,36.83 32.16,36.83 JP1.2 37.31,37.69 38.35,38.73 v41.02,38.73 | JP21.1 68.17,3.81 v68.58,3.81 | R5.1 40.22,49.49 v40.26,49.53 39.88,49.91 37.72,49.91 37.21,50.42 37.21,52.45 38.1,53.34 JP12.1 | JP15.1 v26.67,7.62
  Bottom 0.254: v17.4,38.61 17.4,35.18 v15.24,33.02 | v40.26,49.53 41.02,48.77 v41.02,38.73 | 27.94,10.79 27.94,8.89 v26.67,7.62 | v68.58,3.81 66.04,1.27 32.26,1.27 30.48,3.05 30.48,8.26 27.94,10.79 | v30.48,36.83 27.94,34.29 27.94,10.79
  pour Top: -3.81,-1.27 -3.81,57.15 82.55,57.15 82.55,-1.27
IN_BAT
  Top 0.254: S1.2 8.92,44.76 8.92,47.88 D5.C
IRQ  (via drill 0.35)
  Top 0.254: U1.22 63.48,52.09 J6.2 68.58,49.53 v73.15,49.53 | JP7.2 34.29,51.69 v34.8,51.18
  Bottom 0.254: v34.8,51.18 34.8,39.62 38.86,35.56 70.87,35.56 72.54,37.24 72.54,48.92 v73.15,49.53
MISO  (via drill 0.35)
  Top 0.254: JP18.1 26.67,2.79 v25.27,1.39 | v7.37,3.43 3.81,6.99 v3.81,8.89 | J8.1 6.86,17.78 8.64,19.56 8.64,21.59 9.78,22.73 14.99,22.73 16.25,21.47 U3.16
  Bottom 0.254: v25.27,1.39 9.4,1.39 v7.37,3.43 | v3.81,8.89 6.35,11.43 J8.1
MOSI  (via drill 0.35)
  Top 0.254: JP19.1 v4.88,26.47 5.08,26.26 5.08,21.59 J8.4 | U3.15 17.05,22.32 15.62,23.75 9.27,23.75 8,25.02 v8,26.67
  Bottom 0.254: v8,26.67 5.08,26.67 v4.88,26.47
N$1  (via drill 0.35)
  Top 0.254: U1.12 52.64,41.21 54.61,39.24 J1.4 54.61,37.47 v57.4,34.67 | v65.91,31.75 67.18,30.48 R4.2
  Bottom 0.254: v65.91,31.75 62.99,34.67 v57.4,34.67
N$2
  Top 0.254: C2.1 19.08,41.03 U2.4
N$3
  Top 0.254: U1.13 54.04,41.46 57.15,38.35 J1.3 60.96,34.29 67.31,34.29 68.58,33.02 R3.2
N$4
  Top 0.254: U1.14 55.44,41.72 57.28,39.88 57.91,39.88 J1.2 62.23,35.56 R2.2
N$5
  Top 0.254: U1.15 56.84,41.59 57.66,40.77 60.96,40.77 62.23,39.5 J1.1 63.5,36.83 73.66,36.83 74.93,38.1 R1.2
N$6  (via drill 0.35)
  Top 0.254: R4.1 77.05,31.11 76.42,31.75 v73.66,31.75 | v73.66,39.5 76.2,39.5 77.34,40.64 D4.A
  Bottom 0.254: v73.66,31.75 v73.66,39.5
N$7
  Top 0.254: R3.1 78.54,34.51 78.54,41.78 77.14,43.18 D3.A
N$8  (via drill 0.35)
  Top 0.254: D2.A 77.97,44.83 v78.03,44.83 | v77.47,35.56 R2.1
  Bottom 0.254: v78.03,44.83 78.41,44.45 78.41,36.5 v77.47,35.56
N$9  (via drill 0.35)
  Top 0.254: R1.1 v77.47,38.1 | v76.33,50.04 76.33,49.01 D1.A
  Bottom 0.254: v76.33,50.04 76.33,41.15 77.47,40.01 v77.47,38.1
N$14
  Top 0.254: U1.11 51.24,40.96 52.07,40.13 J2.1
N$15
  Top 0.254: R6.1 35.14,49.06 33.27,50.93 JP7.1
N$16
  Top 0.254: J2.2 49.84,38.41 U1.10
N$17
  Top 0.254: U1.9 48.44,41.39 46.99,39.94 J2.3
N$18  (via drill 0.35)
  Top 0.254: v41.91,50.8 45.72,50.8 45.83,50.69 U1.4
  Bottom 0.254: J2.4 41.91,40.64 v41.91,50.8
N$19
  Top 0.254: JP7.3 36.07,52.58 36.07,49.78 37.59,48.26 R5.2
N$20
  Top 0.254: D5.A 5.94,51.66 J3.1
N$21
  Top 0.254: U3.7 26.7,18.51 27.94,17.27 Y1.2 29.04,11.85 C4.2
N$22
  Top 0.254: JP12.2 39.37,52.58 38.52,51.73 R7.1
N$23
  Top 0.254: U3.8 26.64,22.61 27.81,22.61 | 27.81,22.61 Y1.1 | C5.2 28.92,23.71 27.81,22.61
N$24
  Top 0.254: J10.1 6.35,12.06 9.14,14.86 12.57,14.86 12.92,14.51 U3.23
N$25
  Top 0.254: U3.24 8.89,7.84 J10.2
N$26
  Top 0.254: U3.25 15.01,12.22 11.43,8.64 J10.3
N$27
  Top 0.254: U3.26 17.05,11.08 13.97,8 J10.4
N$28  (via drill 0.35)
  Top 0.254: JP14.1 v29.21,7.62
  Bottom 0.254: J9.CTS 22.86,3.81 26.67,3.81 29.21,6.35 v29.21,7.62
N$29
  Top 0.254: U3.27 17.85,8.96 J10.5
N$30
  Top 0.254: U3.28 18.65,8.02 J10.6
N$31  (via drill 0.35)
  Top 0.254: U3.19 17.71,17.71 v17.78,17.78
  Bottom 0.254: J10.7 21.59,11.43 20.32,12.7 20.32,15.24 v17.78,17.78
N$32  (via drill 0.35)
  Top 0.254: U3.22 18.98,15.31 20.32,13.97 v21.59,13.97
  Bottom 0.254: v21.59,13.97 21.59,12.83 24.13,10.29 J10.8
N$33  (via drill 0.35)
  Top 0.254: U3.32 22.07,12.22 25.53,8.76 30.99,8.76 v32.13,9.91 | v33.02,29.84 30.1,32.77 18.92,32.77 17.5,31.34 11.02,31.34 10.16,30.48 J11.1
  Bottom 0.254: v33.02,29.84 33.02,10.79 v32.13,9.91
N$34  (via drill 0.35)
  Top 0.254: U3.1 23.88,13.18 v23.88,12.32
  Bottom 0.254: v23.88,12.32 26.67,15.11 26.67,29.21 25.4,30.48 13.97,30.48 12.7,29.21 J11.2
N$35  (via drill 0.35)
  Top 0.254: U3.2 v24.59,14.51
  Bottom 0.254: v24.59,14.51 25.4,15.32 25.4,27.94 23.62,29.72 17.02,29.72 J11.3
N$36
  Top 0.254: U3.9 21.85,21.82 24.51,24.48 24.51,28.83 23.75,29.59 19.43,29.59 J11.4
N$37
  Top 0.254: U3.10 21.05,22.07 21.59,22.61 21.59,26.67 J11.5
N$38  (via drill 0.35)
  Top 0.254: U3.11 20.25,19.88 v21.34,18.8
  Bottom 0.254: J11.6 24.51,26.29 24.51,21.97 v21.34,18.8
N$39  (via drill 0.35)
  Top 0.254: U3.13 18.65,19.7 v19.43,18.92 | J12.5 v20.32,22.73
  Bottom 0.254: v19.43,18.92 20.32,19.81 v20.32,22.73
N$40
  Top 0.254: J12.4 17.78,24.13 19.45,22.46 U3.12
N$41  (via drill 0.35)
  Top 0.254: U3.14 17.78,20.87 v17.78,22.86
  Bottom 0.254: v17.78,22.86 18.67,23.75 21.72,23.75 22.86,24.89 J12.6
N$42
  Top 0.254: R11.2 71.97,12.19 70.53,10.75 S3.1
N$43
  Top 0.254: R12.1 74.08,12.19 75.53,10.75 S3.3
N$44
  Top 0.254: D6.A 15.63,40.61 R15.1
RX
  Top 0.254: J9.RXI 15.24,6.35 19.76,6.35 20.32,6.91 20.32,12.14 U3.30
SCK  (via drill 0.35)
  Top 0.254: JP17.1 6.35,25.4 7.87,23.88 7.87,21.84 J8.3 | U3.17 14.76,19.66 v14.1,20.32
  Bottom 0.254: v14.1,20.32 J8.3
TX  (via drill 0.35)
  Top 0.254: U3.31 21.05,10.7 22.86,8.89 22.86,3.81 21.59,2.54 v19.05,2.54
  Bottom 0.254: v19.05,2.54 J9.TXO
V_BAT  (via drill 0.35)
  Top 0.254: J4.2 J4.1 11.39,48.22 S1.3 | JP9.1 5.43,37.24 v4.32,38.35
  Bottom 0.254: J4.1 10.16,49.53 4.32,43.69 v4.32,38.35
V_IN  (via drill 0.35)
  Top 0.254: J4.6 J4.5 17.78,46.7 | 17.78,46.7 U2.1 14.52,45.4 C1.+ | 17.78,46.7 17.78,44.45 16.83,43.5 U2.3 | JP9.2 6.35,33.88 8.1,32.13 16.51,32.13 v17.53,33.15
  Bottom 0.254: v17.53,33.15 19.3,34.92 19.3,48.01 J4.5
V_OUT  (via drill 0.35)
  Top 0.254: U2.5 21.04,45.4 C3.+ 20.32,47.22 J4.7 J4.8 | JP10.1 v11.43,35.56
  Bottom 0.254: v11.43,35.56 11.43,33.66 13.08,32 18.92,32 20.32,33.4 J4.7
VDD3V3  (via drill 0.35)
  Top 0.254: U1.6 U1.7 41.53,46.49 | 41.53,46.49 40.14,46.49 J7.2 J7.1 36.42,46.13 JP11.1 33.44,46.55 R6.2 | 41.53,46.49 44.2,43.81 v44.32,43.81
  Bottom 0.254: J6.5 71.37,51.82 71.37,47.24 J5.2 68.58,44.45 44.96,44.45 v44.32,43.81
VDDAON  (via drill 0.35)
  Top 0.254: JP13.1 36.42,42.77 J7.3 J7.4 42.29,43.18 v42.93,42.55 | v43.18,49.53 43.42,49.29 U1.5
  Bottom 0.254: v43.18,49.53 42.93,49.28 v42.93,42.55
VSS  (via drill 0.35)
  Top 0.254: JP1.1 JP6.2 36.42,40.23 J7.5 J7.6 39.75,41.02 v44.2,41.02 46.99,43.81 46.99,45.04 U1.8 44.7,45.09 v44.2,45.59 | U1.16 61.09,42.79 v62.1,41.78 65.38,38.51 68.58,38.51 69.85,39.78 J5.6 D4.C D3.C D2.C D1.C 75.32,49.52 72.77,52.07 68.58,52.07 J6.6 67.16,53.49 U1.23 U1.24 | v40.64,53.34 JP12.3 | v62.87,50.67 59.75,50.67 U1.21
  Bottom 0.254: v62.87,50.67 65.53,53.34 J6.6 | v44.2,45.59 44.2,50.16 41.02,53.34 v40.64,53.34 | v62.1,41.78 44.96,41.78 v44.2,41.02
WAKEUP  (via drill 0.35)
  Top 0.254: U1.2 42.58,53.49 v41.91,54.16 | v31.24,41.91 32.11,41.05 JP6.1
  Bottom 0.254: v31.24,41.91 31.24,50.29 35.23,54.28 41.53,54.28 41.66,54.16 v41.91,54.16 42.73,53.34 45.47,53.34 50.32,48.49 64.3,48.49 65.34,49.53 68.58,49.53 J6.3

### Text on the board
bNames: Indoor Object Tracking | using | UWB Localization | Pranav | Mihir | Balaji | Kavan